# Altium schematic sheet power_supply.SchDoc
size A
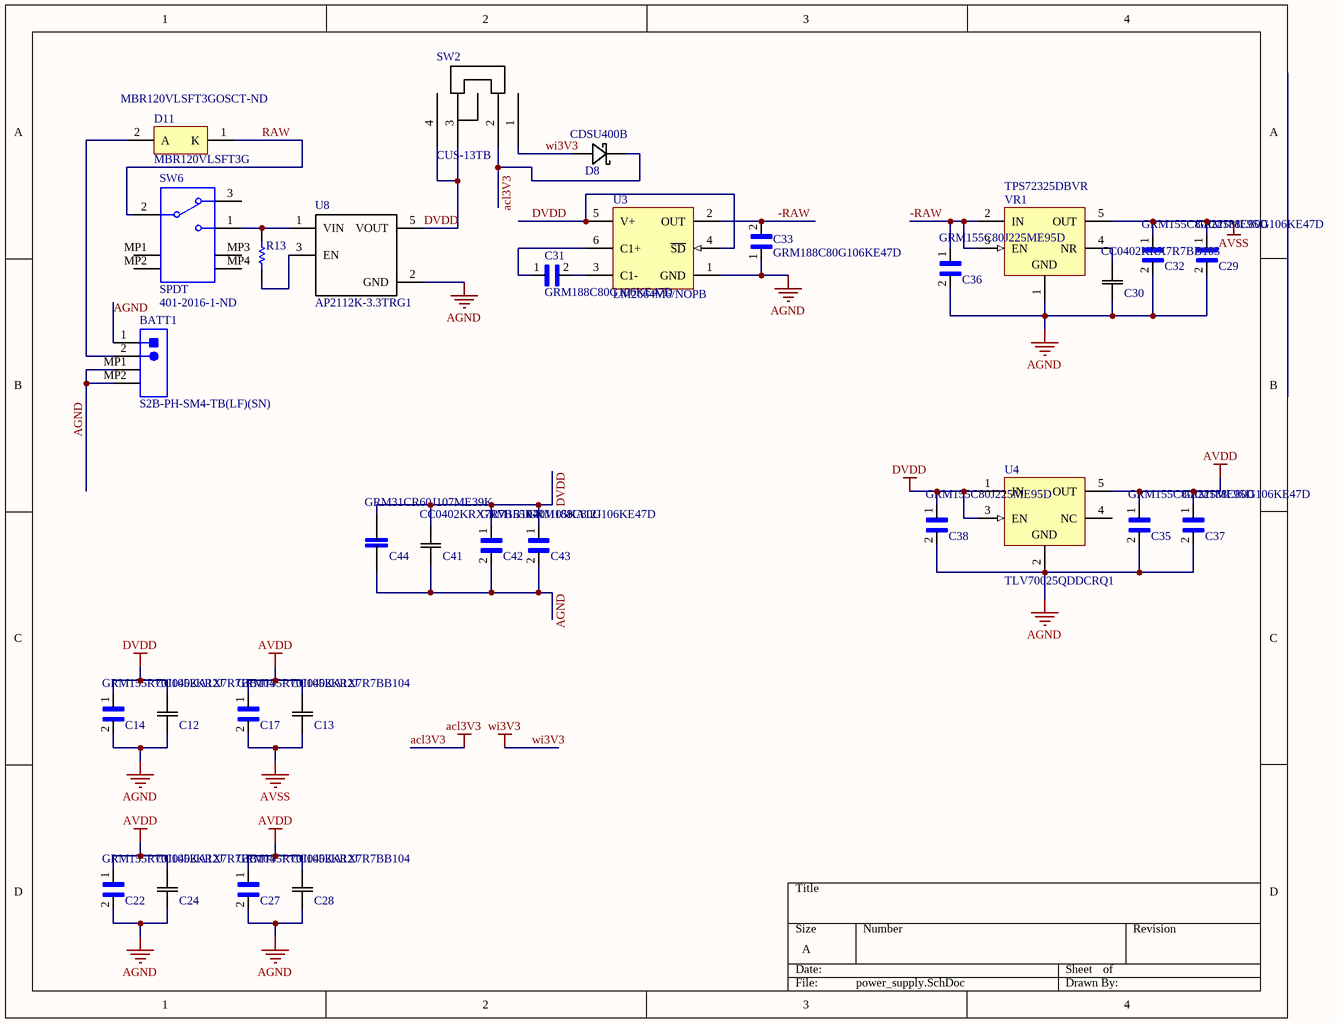
[diagram p0: power_supply.SchDoc]

## Parts
BATT1  S2B-PH-SM4-TB(LF)(SN)  [JST- S2B-PH-SM4-TB(LF)(SN)-2_V]
C12  CC0402KRX7R7BB104  [YAG_CC0402]
C13  CC0402KRX7R7BB104  [YAG_CC0402]
C14  GRM155R70J105KA12J  [*CAPC1005X55N]
C17  GRM155R70J105KA12J  [*CAPC1005X55N]
C22  GRM155R70J105KA12J  [*CAPC1005X55N]
C24  CC0402KRX7R7BB104  [YAG_CC0402]
C27  GRM155R70J105KA12J  [*CAPC1005X55N]
C28  CC0402KRX7R7BB104  [YAG_CC0402]
C29  GRM188C80G106KE47D  [*CAPC1608X90N]
C30  CC0402KRX7R7BB103  [CC0402N]
C31  GRM188C80G106KE47D  [*CAPC1608X90N]
C32  GRM155C80J225ME95D  [*CAPC1005X55N]
C33  GRM188C80G106KE47D  [*CAPC1608X90N]
C35  GRM155C80J225ME95D  [*CAPC1005X55N]
C36  GRM155C80J225ME95D  [*CAPC1005X55N]
C37  GRM188C80G106KE47D  [*CAPC1608X90N]
C38  GRM155C80J225ME95D  [*CAPC1005X55N]
C41  CC0402KRX7R7BB104  [YAG_CC0402]
C42  GRM155R70J105KA12J  [*CAPC1005X55N]
C43  GRM188C80G106KE47D  [*CAPC1608X90N]
C44  GRM31CR60J107ME39K  [*CAPC3216X190]
D8  CDSU400B  [CDBU]
D11  MBR120VLSFT3G  Supplier Part Number 1: MBR120VLSFT3GOSCT-ND  [ONSC-SOD-123FL-2-498-01_V]
R13  10K  [RESC1609X55X30NL15T15]  (value not drawn)
SW2  CUS-13TB  [CUS-13TB]
SW6  SPDT  Supplier Part Number 1: 401-2016-1-ND  [CKCP-PCM12SMTR_V]
U3  LM2664M6/NOPB  [DBV0006A_N]
U4  TLV70025QDDCRQ1  [DDC0005A_N]
U8  AP2112K-3.3TRG1  [*SOT95P285X140-5N]
VR1  TPS72325DBVR  [DBV0005A_N]

## Nets
acl3V3: D8.1 SW2.2
AGND: BATT1.1 BATT1.MP1 BATT1.MP2 C12.2 C14.2 C22.2 C24.2 C27.2 C28.2 C29.2 C30.1 C32.2 C33.1 C35.2 C36.2 C37.2 C38.2 C41.2 C42.2 C43.2 C44.2 U3.1(GND) U4.2(GND) U8.2(GND) VR1.1(GND)
AVDD: C13.1 C17.1 C22.1 C24.1 C27.1 C28.1 C35.1 C37.1 U4.5(OUT)
AVSS: C13.2 C17.2 C29.1 C32.1 VR1.5(OUT)
DVDD: C12.1 C14.1 C38.1 C41.1 C42.1 C43.1 C44.1 SW2.3 SW2.4 U3.4(~{SD}) U3.5(V+) U4.1(IN) U4.3(EN) U8.5(VOUT)
wi3V3: D8.2 SW2.1
-RAW: C33.2 C36.1 U3.2(OUT) VR1.2(IN) VR1.3(EN)
RAW: D11.1(K) SW6.2
NetBATT1_2: BATT1.2 D11.2(A)
NetC30_2: C30.2 VR1.4(NR)
NetC31_1: C31.1 U3.6(C1+)
NetC31_2: C31.2 U3.3(C1-)
NetR13_1: R13.1 U8.3(EN)
NetR13_2: R13.2 SW6.1 U8.1(VIN)

Not connected (* = marked no-connect by the designer): SW6 3 MP1 MP2 MP3 MP4; U4 4(NC)

## Library data of the parts
BATT1 = S2B-PH-SM4-TB(LF)(SN): Manufacturer 1: JST; Supplier 1: Digi-Key; Manufacturer Part Number 1: S2B-PH-SM4-TB(LF)(SN); Stock 1: 99373; Pricing 1: 1=0.58000, 10=0.54700, 100=0.41940, 500=0.36470 (USD); RoHS: No; Supplier Part Number 1: 455-1749-1-ND
C12 C13 C24 C28 C41 = CC0402KRX7R7BB104: CAP CER 0.1UF 16V X7R 0402; Manufacturer 1: Yageo; Capacitance: 100nF; Tolerance: 10%; Supplier 1: Digi-Key; Manufacturer Part Number 1: CC0402KRX7R7BB104; Stock 1: 30032352; Pricing 1: 1=0.10000, 10=0.03200, 100=0.01420, 500=0.01014, 1000=0.00797, 2500=0.00724, 5000=0.00667 (USD); RoHS: Yes; Mount: Surface Mount; Case/Package: 0402; Number of Pins: 2; Case Code (Metric): 1005; Case Code (Imperial): 0402; Min Operating Temperature: -55°C; Max Operating Temperature: 125°C; Voltage Rating: 16V; Voltage Rating (DC): 16V; Packaging: Tape and Reel; Package Quantity: 1; Dielectric: X7R; Termination: SMD/SMT; Composition: Ceramic; Voltage: 16V; Length: 1mm; Height: 0.5mm; Width: 0.02inch; Thickness: 0.022inch; Depth: 0.5mm; Radiation Hardening: No; REACH SVHC: No SVHC; Lead Free: Lead Free; Halogen Free: Halogen Free; ComponentLink1URL: https://datasheet.ciiva.com/11788/0900766b80ce67ed-11788364.pdf?src-supplier=RSComponents; ComponentLink1Description: https://datasheet.ciiva.com/11788/0900766b80ce67ed-11788364.pdf?src-supplier=RSComponents; ComponentLink2URL: https://datasheet.ciiva.com/16625/upy-gphc-x7r-6-3v-to-50v-8-16625511.pdf?src-supplier=Avnet+Europe; ComponentLink2Description: https://datasheet.ciiva.com/16625/upy-gphc-x7r-6-3v-to-50v-8-16625511.pdf?src-supplier=Avnet+Europe; ComponentLink3URL: https://datasheet.ciiva.com/161/mlccorderingcode-161544.pdf?src-supplier=Digi-Key; ComponentLink3Description: https://datasheet.ciiva.com/161/mlccorderingcode-161544.pdf?src-supplier=Digi-Key; ComponentLink4URL: https://datasheet.ciiva.com/161/mlccorderingcode-161545.pdf?src-supplier=Digi-Key; ComponentLink4Description: https://datasheet.ciiva.com/161/mlccorderingcode-161545.pdf?src-supplier=Digi-Key; ComponentLink5URL: https://datasheet.ciiva.com/8033/1734573-8033661.pdf?src-supplier=Element14; ComponentLink5Description: https://datasheet.ciiva.com/8033/1734573-8033661.pdf?src-supplier=Element14; ComponentLink6URL: https://datasheet.ciiva.com/7978/1489800-7978111.pdf?src-supplier=Element14; ComponentLink6Description: https://datasheet.ciiva.com/7978/1489800-7978111.pdf?src-supplier=Element14; ComponentLink7URL: https://datasheet.ciiva.com/8033/1734573-8033663.pdf?src-supplier=Element14; ComponentLink7Description: https://datasheet.ciiva.com/8033/1734573-8033663.pdf?src-supplier=Element14; ComponentLink8URL: https://datasheet.ciiva.com/11587/upy-gphc-x7r-6-3v-to-50v-8-11587305.pdf?src-supplier=Avnet; ComponentLink8Description: https://datasheet.ciiva.com/11587/upy-gphc-x7r-6-3v-to-50v-8-11587305.pdf?src-supplier=Avnet; ComponentLink9URL: https://datasheet.ciiva.com/161/mlccorderingcode-161546.pdf?src-supplier=Digi-Key; ComponentLink9Description: https://datasheet.ciiva.com/161/mlccorderingcode-161546.pdf?src-supplier=Digi-Key; ComponentLink10URL: https://datasheet.ciiva.com/13395/upy-gphc-x7r-6-3v-to-50v-8-13395676.pdf?src-supplier=Mouser; ComponentLink10Description: https://datasheet.ciiva.com/13395/upy-gphc-x7r-6-3v-to-50v-8-13395676.pdf?src-supplier=Mouser; ComponentLink11URL: https://datasheet.ciiva.com/28450/1489800-28450335.pdf?src-supplier=Element14; ComponentLink11Description: https://datasheet.ciiva.com/28450/1489800-28450335.pdf?src-supplier=Element14; Supplier Part Number 1: 311-1338-1-ND
C14 C17 C22 C27 C42 = GRM155R70J105KA12J: CAP CER 1UF 6.3V X7R 0402; Manufacturer 1: Murata; Tolerance: 10%; Supplier 1: Digi-Key; Manufacturer Part Number 1: GRM155R70J105KA12J; Stock 1: 3268614; Pricing 1: 1=0.11000, 10=0.07900, 100=0.03700, 500=0.02596, 1000=0.02149, 2500=0.02000, 5000=0.01830 (USD); RoHS: Yes; Mount: Surface Mount; Case/Package: 0402; Weight: 0.000212oz; Case Code (Metric): 1005; Case Code (Imperial): 0402; Min Operating Temperature: -55°C; Max Operating Temperature: 125°C; Packaging: Tape and Reel; Capacitance: 1uF; Voltage Rating: 6.3V; Dielectric: X7R; Termination: SMD/SMT; Voltage Rating (DC): 6.3V; Package Quantity: 50000; Length: 0.039inch; Width: 0.02inch; Thickness: 0.022inch; ComponentLink1URL: http://www.mouser.com/ds/2/281/c02e-2905.pdf?src-supplier=Mouser; ComponentLink1Description: http://www.mouser.com/ds/2/281/c02e-2905.pdf?src-supplier=Mouser; ComponentLink2URL: http://search.murata.co.jp/Ceramy/image/img/A01X/G101/ENG/GRM155R70J105KA12-01.pdf?src-supplier=Digi-Key; ComponentLink2Description: http://search.murata.co.jp/Ceramy/image/img/A01X/G101/ENG/GRM155R70J105KA12-01.pdf?src-supplier=Digi-Key; Supplier Part Number 1: 490-13339-1-ND
C29 C31 C33 C37 C43 = GRM188C80G106KE47D: CAP CER 10UF 4V X6S 0603; Manufacturer 1: Murata; Tolerance: 10%; Supplier 1: Digi-Key; Manufacturer Part Number 1: GRM188C80G106KE47D; Stock 1: 203819; Pricing 1: 1=0.17000, 10=0.11800, 100=0.05990, 500=0.04098, 1000=0.03625 (USD); RoHS: Yes; Mount: Surface Mount; Case/Package: 0603; Weight: 0.000222oz; Case Code (Metric): 1608; Case Code (Imperial): 0603; Min Operating Temperature: -55°C; Max Operating Temperature: 105°C; Capacitance: 10uF; Packaging: Tape and Reel; Voltage Rating: 4V; Dielectric: X6S; Termination: SMD/SMT; Voltage Rating (DC): 4V; Package Quantity: 4000; Length: 0.063inch; Height: 0.8mm; Width: 0.031inch; Thickness: 0.035inch; ComponentLink1URL: http://www.mouser.com/ds/2/281/c02e-2905.pdf?src-supplier=Mouser; ComponentLink1Description: http://www.mouser.com/ds/2/281/c02e-2905.pdf?src-supplier=Mouser; ComponentLink2URL: http://search.murata.co.jp/Ceramy/image/img/A01X/G101/ENG/GRM188C80G106KE47-01.pdf?src-supplier=Digi-Key; ComponentLink2Description: http://search.murata.co.jp/Ceramy/image/img/A01X/G101/ENG/GRM188C80G106KE47-01.pdf?src-supplier=Digi-Key; Supplier Part Number 1: 490-10469-1-ND
C30 = CC0402KRX7R7BB103: CAP CER 10000PF 16V X7R 0402; Manufacturer 1: Yageo; Capacitance: 10nF; Tolerance: 10%; Insulation Resistance: 10GR; Dissipation Factor: 3.5%; Supplier 1: Digi-Key; Manufacturer Part Number 1: CC0402KRX7R7BB103; Stock 1: 1055821; Pricing 1: 1=0.10000, 10=0.01900, 100=0.00850, 500=0.00610, 1000=0.00479, 2500=0.00436, 5000=0.00401 (USD); RoHS: Yes; Mount: Surface Mount; Case/Package: 0402; Number of Pins: 2; Case Code (Metric): 1005; Case Code (Imperial): 0402; Min Operating Temperature: -55°C; Max Operating Temperature: 125°C; Package Quantity: 1; Voltage Rating: 16V; Packaging: Tape and Reel; Voltage Rating (DC): 16V; Dielectric: X7R; Termination: SMD/SMT; Voltage: 16V; Length: 1mm; Height: 0.5mm; Width: 0.02inch; Thickness: 0.022inch; Depth: 0.5mm; Radiation Hardening: No; REACH SVHC: No SVHC; Lead Free: Lead Free; Halogen Free: Halogen Free; ComponentLink1URL: https://datasheet.ciiva.com/143/upy-gphc-x7r-6-3v-to-50v-8-143952.pdf?src-supplier=Digi-Key; ComponentLink1Description: https://datasheet.ciiva.com/143/upy-gphc-x7r-6-3v-to-50v-8-143952.pdf?src-supplier=Digi-Key; ComponentLink2URL: https://datasheet.ciiva.com/143/mlccorderingcode-143950.pdf?src-supplier=Digi-Key; ComponentLink2Description: https://datasheet.ciiva.com/143/mlccorderingcode-143950.pdf?src-supplier=Digi-Key; ComponentLink3URL: https://datasheet.ciiva.com/143/mlccorderingcode-143951.pdf?src-supplier=Digi-Key; ComponentLink3Description: https://datasheet.ciiva.com/143/mlccorderingcode-143951.pdf?src-supplier=Digi-Key; ComponentLink4URL: https://datasheet.ciiva.com/16625/upy-gphc-x7r-6-3v-to-50v-8-16625510.pdf?src-supplier=Avnet+Europe; ComponentLink4Description: https://datasheet.ciiva.com/16625/upy-gphc-x7r-6-3v-to-50v-8-16625510.pdf?src-supplier=Avnet+Europe; ComponentLink5URL: https://datasheet.ciiva.com/8033/70765-8033655.pdf?src-supplier=Element14; ComponentLink5Description: https://datasheet.ciiva.com/8033/70765-8033655.pdf?src-supplier=Element14; ComponentLink6URL: https://datasheet.ciiva.com/8033/1489800-8033658.pdf?src-supplier=Element14; ComponentLink6Description: https://datasheet.ciiva.com/8033/1489800-8033658.pdf?src-supplier=Element14; ComponentLink7URL: https://datasheet.ciiva.com/28450/1489800-28450330.pdf?src-supplier=Element14; ComponentLink7Description: https://datasheet.ciiva.com/28450/1489800-28450330.pdf?src-supplier=Element14; ComponentLink8URL: https://datasheet.ciiva.com/8033/1489800-8033659.pdf?src-supplier=Element14; ComponentLink8Description: https://datasheet.ciiva.com/8033/1489800-8033659.pdf?src-supplier=Element14; ComponentLink9URL: https://datasheet.ciiva.com/7978/1489800-7978109.pdf?src-supplier=Element14; ComponentLink9Description: https://datasheet.ciiva.com/7978/1489800-7978109.pdf?src-supplier=Element14; ComponentLink10URL: https://datasheet.ciiva.com/5425/upy-gp-np0-16v-to-50v-8-3714-5425438.pdf?src-supplier=Mouser; ComponentLink10Description: https://datasheet.ciiva.com/5425/upy-gp-np0-16v-to-50v-8-3714-5425438.pdf?src-supplier=Mouser; Supplier Part Number 1: 311-1042-1-ND
C32 C35 C36 C38 = GRM155C80J225ME95D: 0402 6.3 V 2.2 uF ±20% Tolerance X6S Monolithic Ceramic Chip Capacitor; Manufacturer 1: Murata; Capacitance: 2.2uF; Voltage Rating: 6.3V; Supplier 1: Digi-Key; Manufacturer Part Number 1: GRM155C80J225ME95D; Stock 1: 46738; Pricing 1: 1=0.12000, 10=0.08200, 100=0.03850, 500=0.02702, 1000=0.02237, 2500=0.02082, 5000=0.01905 (USD); RoHS: Yes; Mount: Surface Mount; Case/Package: 0402; Weight: 0.000212oz; Case Code (Metric): 1005; Case Code (Imperial): 0402; Min Operating Temperature: -55°C; Max Operating Temperature: 105°C; Packaging: Tape and Reel; Tolerance: 20%; Dielectric: X6S; Termination: SMD/SMT; Voltage Rating (DC): 6.3V; Package Quantity: 10000; Length: 0.039inch; Height: 0.5mm; Width: 0.5mm; Thickness: 0.022inch; ComponentLink1URL: http://www.mouser.com/ds/2/281/c02e-2905.pdf?src-supplier=Mouser; ComponentLink1Description: http://www.mouser.com/ds/2/281/c02e-2905.pdf?src-supplier=Mouser; ComponentLink2URL: http://search.murata.co.jp/Ceramy/image/img/A01X/partnumbering_e_01.pdf?src-supplier=Digi-Key; ComponentLink2Description: http://search.murata.co.jp/Ceramy/image/img/A01X/partnumbering_e_01.pdf?src-supplier=Digi-Key; Supplier Part Number 1: 490-10013-1-ND
C44 = GRM31CR60J107ME39K: MURATA - GRM31CR60J107ME39K - COND, 100µF, 6.3V, 20%, X5R, 1206; Capacitance: 100uF; Supplier 1: Digi-Key; Manufacturer 1: Murata; Manufacturer Part Number 1: GRM31CR60J107ME39K; Stock 1: 407390; Pricing 1: 1=0.98000, 10=0.77400, 100=0.58060, 500=0.43870, 1000=0.38709, 2500=0.36128 (USD); RoHS: Yes; Mount: Surface Mount; Case/Package: 1206; Case Code (Imperial): 1206; Case Code (Metric): 3216; Min Operating Temperature: -55°C; Max Operating Temperature: 85°C; Tolerance: 20%; Packaging: Tape and Reel; Package Quantity: 1; Voltage Rating: 6.3V; Dielectric: X5R; Termination: SMD/SMT; Voltage: 6.3V; Voltage Rating (DC): 6.3V; Length: 3.2mm; Height: 1.6mm; Width: 0.063inch; Thickness: 0.071inch; Depth: 1.6mm; Radiation Hardening: No; REACH SVHC: No SVHC; Lead Free: Lead Free; ComponentLink1URL: https://datasheet.ciiva.com/13246/product-13246228.pdf?src-supplier=Mouser; ComponentLink1Description: https://datasheet.ciiva.com/13246/product-13246228.pdf?src-supplier=Mouser; ComponentLink2URL: https://datasheet.ciiva.com/18697/grm31cr60j107me39-01-18697367.pdf?src-supplier=Digi-Key; ComponentLink2Description: https://datasheet.ciiva.com/18697/grm31cr60j107me39-01-18697367.pdf?src-supplier=Digi-Key; ComponentLink3URL: https://datasheet.ciiva.com/18697/grm31cr60j107me39-01-18697368.pdf?src-supplier=Digi-Key; ComponentLink3Description: https://datasheet.ciiva.com/18697/grm31cr60j107me39-01-18697368.pdf?src-supplier=Digi-Key; ComponentLink4URL: https://datasheet.ciiva.com/18697/grm31cr60j107me39-01-18697369.pdf?src-supplier=Digi-Key; ComponentLink4Description: https://datasheet.ciiva.com/18697/grm31cr60j107me39-01-18697369.pdf?src-supplier=Digi-Key; Supplier Part Number 1: 490-7217-1-ND
D8 = CDSU400B: DIODE GEN PURP 80V 100MA 0603; Manufacturer 1: Comchip; Max Surge Current: 1A; Recovery Time: 4ns; Max Power Dissipation: 150mW; Max Reverse Leakage Current: 100nA; Supplier 1: Digi-Key; Manufacturer Part Number 1: CDSU400B; Stock 1: 61022; Pricing 1: 1=0.22000, 10=0.17700, 100=0.09390, 500=0.06180, 1000=0.04202 (USD); RoHS: Yes; Mount: Surface Mount; Case/Package: SMD/SMT; Package Quantity: 1; Packaging: Tape and Reel; Average Rectified Current: 100mA; Reverse Recovery Time: 4ns; Max Reverse Voltage (DC): 80V; ComponentLink1URL: https://datasheet.ciiva.com/911/cdsu400b-revb370614-911825.pdf?src-supplier=Digi-Key; ComponentLink1Description: https://datasheet.ciiva.com/911/cdsu400b-revb370614-911825.pdf?src-supplier=Digi-Key; ComponentLink2URL: https://datasheet.ciiva.com/4435/cdsu400b-revb370614-56727-4435278.pdf?src-supplier=Mouser; ComponentLink2Description: https://datasheet.ciiva.com/4435/cdsu400b-revb370614-56727-4435278.pdf?src-supplier=Mouser; ComponentLink3URL: https://datasheet.ciiva.com/911/cdsu400b-revb370614-911826.pdf?src-supplier=Digi-Key; ComponentLink3Description: https://datasheet.ciiva.com/911/cdsu400b-revb370614-911826.pdf?src-supplier=Digi-Key; ComponentLink4URL: https://datasheet.ciiva.com/911/cdsu400b-revb370614-911827.pdf?src-supplier=Digi-Key; ComponentLink4Description: https://datasheet.ciiva.com/911/cdsu400b-revb370614-911827.pdf?src-supplier=Digi-Key; Supplier Part Number 1: 641-1003-1-ND
D11 = MBR120VLSFT3G: MBR120VLSF Series 20 V 1 A Surface Mount Schottky Power Rectifier - SOD-123FL; Manufacturer 1: ON Semiconductor; Max Surge Current: 45A; Forward Voltage: 340mV; Forward Current: 1A; Peak Reverse Current: 600uA; Max Repetitive Reverse Voltage (Vrrm): 20V; Element Configuration: Single; Polarity: Standard; Supplier 1: Digi-Key; Manufacturer Part Number 1: MBR120VLSFT3G; Stock 1: 101961; Pricing 1: 1=0.40000, 10=0.32100, 100=0.21880, 500=0.16414, 1000=0.12310 (USD); RoHS: Yes; Number of Pins: 2; Min Operating Temperature: -65°C; Max Operating Temperature: 125°C; Package Quantity: 10000; Packaging: Tape and Reel; Max Reverse Leakage Current: 600uA; Average Rectified Current: 1A; Peak Non-Repetitive Surge Current: 45A; Max Forward Surge Current (Ifsm): 45A; Voltage Rating (DC): 20V; Current Rating: 1A; Output Current: 1A; Max Reverse Voltage (DC): 20V; Radiation Hardening: No; REACH SVHC: No SVHC; Lead Free: Lead Free; Halogen Free: Halogen Free; ComponentLink1URL: https://datasheet.ciiva.com/4715/mbr120vlsft1-d-107081-4715104.pdf?src-supplier=Mouser; ComponentLink1Description: https://datasheet.ciiva.com/4715/mbr120vlsft1-d-107081-4715104.pdf?src-supplier=Mouser; ComponentLink2URL: https://datasheet.ciiva.com/6380/mbr120vlsft1-d-6380907.pdf?src-supplier=Digi-Key; ComponentLink2Description: https://datasheet.ciiva.com/6380/mbr120vlsft1-d-6380907.pdf?src-supplier=Digi-Key; ComponentLink3URL: https://datasheet.ciiva.com/8294/mbr120vlsft1-d-8294603.pdf?src-supplier=Avnet; ComponentLink3Description: https://datasheet.ciiva.com/8294/mbr120vlsft1-d-8294603.pdf?src-supplier=Avnet; ComponentLink4URL: https://datasheet.ciiva.com/6380/mbr120vlsft1-d-6380910.pdf?src-supplier=Digi-Key; ComponentLink4Description: https://datasheet.ciiva.com/6380/mbr120vlsft1-d-6380910.pdf?src-supplier=Digi-Key
R13 = ERJ-3EKF1002V: Res Thick Film 0603 10K Ohm 1% 1/10W ±100ppm/°C Molded SMD Punched Carrier T/R; Manufacturer 1: Panasonic; Resistance: 10kR; Power Rating: 100mW; Voltage Rating: 75V; Supplier 1: Digi-Key; Manufacturer Part Number 1: ERJ-3EKF1002V; Stock 1: 6176372; Pricing 1: 1=0.10000, 10=0.06500, 100=0.02640, 1000=0.01186, 2500=0.01029 (USD); RoHS: Yes; Mount: Surface Mount; Case/Package: 0603; Number of Pins: 2; Case Code (Metric): 1608; Case Code (Imperial): 0603; Contact Plating: Tin; Min Operating Temperature: -55°C; Max Operating Temperature: 155°C; Tolerance: 1%; Packaging: Tape and Reel; Package Quantity: 1; Composition: Thick Film; Number of Terminations: 2; Termination: SMD/SMT; Temperature Coefficient: 100ppm/°C; Military Standard: Not; Max Power Dissipation: 100mW; Voltage Rating (DC): 75V; Features: Automotive AEC-Q200; Length: 1.6mm; Height: 0.45mm; Width: 0.031inch; Depth: 0.8mm; Radiation Hardening: No; REACH SVHC: No SVHC; Lead Free: Lead Free; ComponentLink1URL: http://www.farnell.com/datasheets/1911175.pdf?src-supplier=Farnell; ComponentLink1Description: http://www.farnell.com/datasheets/1911175.pdf?src-supplier=Farnell; ComponentLink2URL: http://components.arrow.com/part/dataview/0323_02069964?src-supplier=Arrow+Europe; ComponentLink2Description: http://components.arrow.com/part/dataview/0323_02069964?src-supplier=Arrow+Europe; ComponentLink3URL: https://industrial.panasonic.com/cdbs/www-data/pdf/RDA0000/DMA0000COL11.pdf?src-supplier=Distrelec; ComponentLink3Description: https://industrial.panasonic.com/cdbs/www-data/pdf/RDA0000/DMA0000COL11.pdf?src-supplier=Distrelec; ComponentLink4URL: https://industrial.panasonic.com/cdbs/www-data/pdf/RDA0000/DMA0000COL11.pdf?src-supplier=Future+Electronics; ComponentLink4Description: https://industrial.panasonic.com/cdbs/www-data/pdf/RDA0000/DMA0000COL11.pdf?src-supplier=Future+Electronics; ComponentLink5URL: http://www.jameco.com/Jameco/Products/ProdDS/1987468.pdf?src-supplier=Jameco; ComponentLink5Description: http://www.jameco.com/Jameco/Products/ProdDS/1987468.pdf?src-supplier=Jameco; ComponentLink6URL: https://industrial.panasonic.com/cdbs/www-data/pdf/RDA0000/DMA0000COL11.pdf?src-supplier=Allied+Electronics; ComponentLink6Description: https://industrial.panasonic.com/cdbs/www-data/pdf/RDA0000/DMA0000COL11.pdf?src-supplier=Allied+Electronics; ComponentLink7URL: https://industrial.panasonic.com/cdbs/www-data/pdf/RDA0000/DMA0000COL11.pdf?src-supplier=Conrad; ComponentLink7Description: https://industrial.panasonic.com/cdbs/www-data/pdf/RDA0000/DMA0000COL11.pdf?src-supplier=Conrad
SW2 = CUS-13TB: SWITCH SLIDE SP3T 300MA 4V; Manufacturer 1: Nidec Copal; Actuator Material: Nylon,Polyamide; Max Voltage Rating (DC): 20V; Electrical Life: 10000Cycles; Switch Travel: 1.5mm; Switch Function: On-On-On; Actuator Type: Standard; Supplier 1: Digi-Key; Manufacturer Part Number 1: CUS-13TB; Stock 1: 8665; Pricing 1: 1=0.74000, 10=0.71200, 25=0.69760, 50=0.62320, 100=0.59360, 250=0.57876, 500=0.48972, 1000=0.47488 (USD); RoHS: Yes; Mount: Surface Mount; Contact Plating: Gold; Contact Material: Copper Alloy; Min Operating Temperature: -20°C; Max Operating Temperature: 70°C; Voltage Rating (DC): 4V; Packaging: Tape and Reel; Current Rating: 300mA; Termination: Gull Wing; Throw Configuration: SP3T; Orientation: Right Angle; Actuator Length: 1.5mm; Radiation Hardening: No; ComponentLink1URL: https://datasheet.ciiva.com/2889/cus-2889142.pdf?src-supplier=Digi-Key; ComponentLink1Description: https://datasheet.ciiva.com/2889/cus-2889142.pdf?src-supplier=Digi-Key; ComponentLink2URL: https://datasheet.ciiva.com/2889/cus-2889143.pdf?src-supplier=Digi-Key; ComponentLink2Description: https://datasheet.ciiva.com/2889/cus-2889143.pdf?src-supplier=Digi-Key; ComponentLink3URL: https://datasheet.ciiva.com/2889/cus-2889144.pdf?src-supplier=Digi-Key; ComponentLink3Description: https://datasheet.ciiva.com/2889/cus-2889144.pdf?src-supplier=Digi-Key; Supplier Part Number 1: 563-1103-1-ND
SW6 = PCM12SMTR: C & K COMPONENTS - PCM12SMTR - SWITCH, SPDT, 0.3A, 6VDC, SMD; Manufacturer 1: ITT C&K; Mechanical Life: 10000Cycles; Actuator Material: Nylon,Polyamide; Voltage Rating (AC): 6V; Contact Resistance: 70mR; Max Current Rating: 300mA; Insulation Resistance: 100mR; Switch Travel: 1.5mm; Switch Function: On-On; Actuator Type: Standard; Supplier 1: Digi-Key; Manufacturer Part Number 1: PCM12SMTR; Stock 1: 24379; Pricing 1: 1=0.91000, 10=0.87000, 25=0.85240, 50=0.76160, 100=0.72530, 250=0.70720, 500=0.59840, 1000=0.58027 (USD); RoHS: Yes; Mount: Surface Mount; Contact Material: Copper Alloy,Copper,Silver; Contact Plating: Silver; Min Operating Temperature: -20°C; Max Operating Temperature: 85°C; Package Quantity: 1; Packaging: Tape and Reel; Throw Configuration: SPDT; Voltage Rating (DC): 6V; Max Voltage Rating (DC): 6V; Contact Current Rating: 300mA; Current Rating: 300mA; Termination: Gull Wing; Orientation: Right Angle; Length: 7.7mm; Width: 6.7mm; Depth: 5mm; Actuator Length: 1.5mm; REACH SVHC: No SVHC; Lead Free: Lead Free; ComponentLink1URL: https://datasheet.ciiva.com/16462/pcm-13nov13-16462516.pdf?src-supplier=Avnet+Asia; ComponentLink1Description: https://datasheet.ciiva.com/16462/pcm-13nov13-16462516.pdf?src-supplier=Avnet+Asia; ComponentLink2URL: https://datasheet.ciiva.com/16475/pcm12smtr-16475766.pdf?src-supplier=Future+Electronics; ComponentLink2Description: https://datasheet.ciiva.com/16475/pcm12smtr-16475766.pdf?src-supplier=Future+Electronics; ComponentLink3URL: https://datasheet.ciiva.com/16174/pcm-30mar11-16174552.pdf?src-supplier=Onlinecomponents.com; ComponentLink3Description: https://datasheet.ciiva.com/16174/pcm-30mar11-16174552.pdf?src-supplier=Onlinecomponents.com; ComponentLink4URL: https://datasheet.ciiva.com/1532/1685524-1532411.pdf?src-supplier=Element14; ComponentLink4Description: https://datasheet.ciiva.com/1532/1685524-1532411.pdf?src-supplier=Element14; ComponentLink5URL: https://datasheet.ciiva.com/5279/pcm-5oct11-24112-5279535.pdf?src-supplier=Mouser; ComponentLink5Description: https://datasheet.ciiva.com/5279/pcm-5oct11-24112-5279535.pdf?src-supplier=Mouser; ComponentLink6URL: https://datasheet.ciiva.com/2889/pcm-13nov13-2889154.pdf?src-supplier=Digi-Key; ComponentLink6Description: https://datasheet.ciiva.com/2889/pcm-13nov13-2889154.pdf?src-supplier=Digi-Key; ComponentLink7URL: https://datasheet.ciiva.com/2889/pcm-13nov13-2889155.pdf?src-supplier=Digi-Key; ComponentLink7Description: https://datasheet.ciiva.com/2889/pcm-13nov13-2889155.pdf?src-supplier=Digi-Key; ComponentLink8URL: https://datasheet.ciiva.com/2889/pcm-13nov13-2889156.pdf?src-supplier=Digi-Key; ComponentLink8Description: https://datasheet.ciiva.com/2889/pcm-13nov13-2889156.pdf?src-supplier=Digi-Key
U3 = LM2664M6/NOPB: IC REG SWTCHD CAP INV 40MA SOT23; Manufacturer 1: TI National Semiconductor; Max Supply Voltage: 5.5V; Min Supply Voltage: 1.8V; Output Voltage: -5.5V; Number of Outputs: 1; Frequency: 160kHz; Max Power Dissipation: 600mW; Nominal Supply Current: 500uA; Logic Function: Inverting; Max Output Voltage: -1.8V; Output Power: 500mW; Output Type: Adjustable; Topology: Buck-Boost; Supplier 1: Digi-Key; Manufacturer Part Number 1: LM2664M6/NOPB; Stock 1: 24349; Pricing 1: 1=0.89000, 10=0.79300, 100=0.61830, 500=0.51078 (USD); RoHS: Yes; Mount: Surface Mount; Case/Package: SOT-23; Number of Pins: 6; Min Operating Temperature: -40°C; Max Operating Temperature: 85°C; Packaging: Tape and Reel; Output Current: 40mA; Min Input Voltage: 1.8V; Max Input Voltage: 5.5V; Switching Frequency: 160kHz; Package Quantity: 1000; Min Output Voltage: -5.5V; Termination: SMD/SMT; Max Output Current: 40mA; Length: 2.92mm; Height: 1.02mm; Width: 1.6mm; Radiation Hardening: No; REACH SVHC: No SVHC; Lead Free: Lead Free; ComponentLink1URL: https://datasheet.ciiva.com/1641/1703149-1641090.pdf?src-supplier=Newark; ComponentLink1Description: https://datasheet.ciiva.com/1641/1703149-1641090.pdf?src-supplier=Newark; ComponentLink2URL: https://datasheet.ciiva.com/15114/getdatasheetpartid-117448-15114290.pdf?src-supplier=Verical; ComponentLink2Description: https://datasheet.ciiva.com/15114/getdatasheetpartid-117448-15114290.pdf?src-supplier=Verical; ComponentLink3URL: https://datasheet.ciiva.com/27055/1992911-27055843.pdf?src-supplier=Jameco; ComponentLink3Description: https://datasheet.ciiva.com/27055/1992911-27055843.pdf?src-supplier=Jameco; ComponentLink4URL: https://datasheet.ciiva.com/22669/1811104-22669560.pdf?src-supplier=Element14; ComponentLink4Description: https://datasheet.ciiva.com/22669/1811104-22669560.pdf?src-supplier=Element14; ComponentLink5URL: https://datasheet.ciiva.com/5699/1853535-5699178.pdf?src-supplier=Farnell; ComponentLink5Description: https://datasheet.ciiva.com/5699/1853535-5699178.pdf?src-supplier=Farnell; ComponentLink6URL: https://datasheet.ciiva.com/6579/lm2664-6579834.pdf?src-supplier=Digi-Key; ComponentLink6Description: https://datasheet.ciiva.com/6579/lm2664-6579834.pdf?src-supplier=Digi-Key; ComponentLink7URL: https://datasheet.ciiva.com/6579/lm2664-6579836.pdf?src-supplier=Digi-Key; ComponentLink7Description: https://datasheet.ciiva.com/6579/lm2664-6579836.pdf?src-supplier=Digi-Key; ComponentLink8URL: https://datasheet.ciiva.com/6579/lm2664-6579837.pdf?src-supplier=Digi-Key; ComponentLink8Description: https://datasheet.ciiva.com/6579/lm2664-6579837.pdf?src-supplier=Digi-Key; ComponentLink9URL: https://datasheet.ciiva.com/25902/lm2664-25902046.pdf?src-supplier=Avnet+Europe; ComponentLink9Description: https://datasheet.ciiva.com/25902/lm2664-25902046.pdf?src-supplier=Avnet+Europe; Supplier Part Number 1: LM2664M6/NOPBCT-ND
U4 = TLV70025QDDCRQ1: LDO Regulator Pos 2.5V 0.2A 5-Pin SOT T/R; Manufacturer 1: Texas Instruments; Output Current: 200mA; Number of Outputs: 1; Max Power Dissipation: 500mW; Dropout Voltage: 175mV; Max Input Voltage: 5.5V; Min Input Voltage: 2V; Min Current Limit: 220mA; Polarity: Positive; Accuracy: 2%; Quiescent Current: 30uA; Output Type: Fixed; Supplier 1: Digi-Key; Manufacturer Part Number 1: TLV70025QDDCRQ1; Stock 1: 2422; Pricing 1: 1=0.65000, 10=0.55200, 100=0.41240, 500=0.32404, 1000=0.25039 (USD); RoHS: Yes; Case/Package: SOT-23-5; Number of Pins: 5; Min Operating Temperature: -40°C; Max Operating Temperature: 125°C; Package Quantity: 1; Output Voltage: 2.5V; Packaging: Tape and Reel; Max Output Current: 200mA; Number of Regulators: 1; Power Dissipation: 500mW; Output Voltage Accuracy: 2%; Max Output Voltage: 2.5V; Min Output Voltage: 2.5V; Radiation Hardening: No; Lead Free: Lead Free; ComponentLink1URL: https://datasheet.ciiva.com/29568/tlv70025-q1-29568375.pdf?src-supplier=Digi-Key; ComponentLink1Description: https://datasheet.ciiva.com/29568/tlv70025-q1-29568375.pdf?src-supplier=Digi-Key; ComponentLink2URL: https://datasheet.ciiva.com/12958/slvsa61c-120807-12958385.pdf?src-supplier=Mouser; ComponentLink2Description: https://datasheet.ciiva.com/12958/slvsa61c-120807-12958385.pdf?src-supplier=Mouser; Supplier Part Number 1: 296-36764-1-ND
U8 = AP2112K-3.3TRG1: IC REG LINEAR 3.3V 600MA SOT25; Manufacturer 1: Diodes; Min Input Voltage: 2.5V; Number of Outputs: 1; Dropout Voltage: 250mV; Max Input Voltage: 6V; Quiescent Current: 55uA; Polarity: Positive; Accuracy: 1.5%; Output Type: Fixed; Supplier 1: Digi-Key; Manufacturer Part Number 1: AP2112K-3.3TRG1; Stock 1: 101506; Pricing 1: 1=0.47000, 10=0.35100, 100=0.21890, 500=0.14976, 1000=0.11520 (USD); RoHS: Yes; Mount: Surface Mount; Case/Package: SOT-23-5; Number of Pins: 5; Min Operating Temperature: -40°C; Max Operating Temperature: 85°C; Package Quantity: 1; Packaging: Tape and Reel; Output Voltage: 3.3V; Output Current: 600mA; Number of Regulators: 1; Max Output Current: 600mA; Length: 3.1mm; Height: 1.3mm; Width: 1.7mm; Lead Free: Lead Free; ComponentLink1URL: https://datasheet.ciiva.com/30016/ap2112-30016792.pdf?src-supplier=Avnet; ComponentLink1Description: https://datasheet.ciiva.com/30016/ap2112-30016792.pdf?src-supplier=Avnet; ComponentLink2URL: https://datasheet.ciiva.com/29569/ap2112-29569917.pdf?src-supplier=Digi-Key; ComponentLink2Description: https://datasheet.ciiva.com/29569/ap2112-29569917.pdf?src-supplier=Digi-Key; ComponentLink3URL: https://datasheet.ciiva.com/29569/ap2112-29569918.pdf?src-supplier=Digi-Key; ComponentLink3Description: https://datasheet.ciiva.com/29569/ap2112-29569918.pdf?src-supplier=Digi-Key; ComponentLink4URL: https://datasheet.ciiva.com/29569/ap2112-29569919.pdf?src-supplier=Digi-Key; ComponentLink4Description: https://datasheet.ciiva.com/29569/ap2112-29569919.pdf?src-supplier=Digi-Key; Supplier Part Number 1: AP2112K-3.3TRG1DICT-ND
VR1 = TPS72325DBVR: 200 mA Low-Noise, High-PSRR Negative Output Low-Dropout Linear Regulators; Manufacturer 1: Texas Instruments; Nominal Output Voltage: -2.5V; Number of Outputs: 1; Max Power Dissipation: 560mW; Dropout Voltage: 280mV; Output Current: 200mA; Max Input Voltage: -2.7V; Min Input Voltage: -10V; Min Current Limit: 300mA; Input Bias Current: 130uA; Output Voltage Accuracy: 1%; Accuracy: 2%; Output Type: Fixed; Supplier 1: Digi-Key; Manufacturer Part Number 1: TPS72325DBVR; Stock 1: 4645; Pricing 1: 1=2.81000, 10=2.52200, 100=2.02720, 500=1.66552, 1000=1.37999 (USD); RoHS: Yes; Case/Package: SOT-23; Number of Pins: 5; Contact Plating: Tin,Matte; Min Operating Temperature: -40°C; Max Operating Temperature: 125°C; Packaging: Tape and Reel; Output Voltage: -2.5V; Package Quantity: 3000; Max Output Current: 200mA; Number of Regulators: 1; Polarity: Negative; Power Dissipation: 560mW; Min Output Voltage: -2.5V; Quiescent Current: 130uA; Max Output Voltage: -2.5V; Radiation Hardening: No; REACH SVHC: No SVHC; Lead Free: Lead Free; ComponentLink1URL: http://www.mouser.com/ds/2/405/slvs346c-521947.pdf?src-supplier=Mouser; ComponentLink1Description: http://www.mouser.com/ds/2/405/slvs346c-521947.pdf?src-supplier=Mouser; ComponentLink2URL: http://components.arrow.com/part/dataview/0323_00141856?src-supplier=Arrow+Europe; ComponentLink2Description: http://components.arrow.com/part/dataview/0323_00141856?src-supplier=Arrow+Europe; ComponentLink3URL: http://www.ti.com/general/docs/lit/getliterature.tsp?genericPartNumber=TPS723&amp;&amp;fileType=pdf&src-supplier=Farnell; ComponentLink3Description: http://www.ti.com/general/docs/lit/getliterature.tsp?genericPartNumber=TPS723&amp;&amp;fileType=pdf&src-supplier=Farnell; ComponentLink4URL: http://www.ti.com/general/docs/lit/getliterature.tsp?genericPartNumber=TPS723&&fileType=pdf&src-supplier=Element14; ComponentLink4Description: http://www.ti.com/general/docs/lit/getliterature.tsp?genericPartNumber=TPS723&&fileType=pdf&src-supplier=Element14; ComponentLink5URL: http://www.ti.com/general/docs/lit/getliterature.tsp?genericPartNumber=TPS723&&fileType=pdf&src-supplier=Avnet+Asia; ComponentLink5Description: http://www.ti.com/general/docs/lit/getliterature.tsp?genericPartNumber=TPS723&&fileType=pdf&src-supplier=Avnet+Asia; ComponentLink6URL: http://www.ti.com/general/docs/lit/getliterature.tsp?genericPartNumber=TPS723&&fileType=pdf&src-supplier=Avnet; ComponentLink6Description: http://www.ti.com/general/docs/lit/getliterature.tsp?genericPartNumber=TPS723&&fileType=pdf&src-supplier=Avnet; ComponentLink7URL: http://www.ti.com/lit/ds/symlink/tps723.pdf?src-supplier=Digi-Key; ComponentLink7Description: http://www.ti.com/lit/ds/symlink/tps723.pdf?src-supplier=Digi-Key; ComponentLink8URL: http://www.ti.com/general/docs/lit/getliterature.tsp?genericPartNumber=TPS723&amp;&amp;fileType=pdf&src-supplier=Newark; ComponentLink8Description: http://www.ti.com/general/docs/lit/getliterature.tsp?genericPartNumber=TPS723&amp;&amp;fileType=pdf&src-supplier=Newark; ComponentLink9URL: http://focus.ti.com/lit/ds/symlink/tps72325.pdf?src-supplier=Avnet+Europe; ComponentLink9Description: http://focus.ti.com/lit/ds/symlink/tps72325.pdf?src-supplier=Avnet+Europe; ComponentLink10URL: http://components.arrow.com/part/dataview/40177093S9611537N7713?src-supplier=Arrow; ComponentLink10Description: http://components.arrow.com/part/dataview/40177093S9611537N7713?src-supplier=Arrow; ComponentLink11URL: http://www.ti.com/lit/ds/symlink/tps72301.pdf?src-supplier=Digi-Key; ComponentLink11Description: http://www.ti.com/lit/ds/symlink/tps72301.pdf?src-supplier=Digi-Key; Supplier Part Number 1: 296-39479-1-ND